# Altium schematic sheet MAIN.SchDoc
size A; SheetNumber: 1; SheetTotal: 8
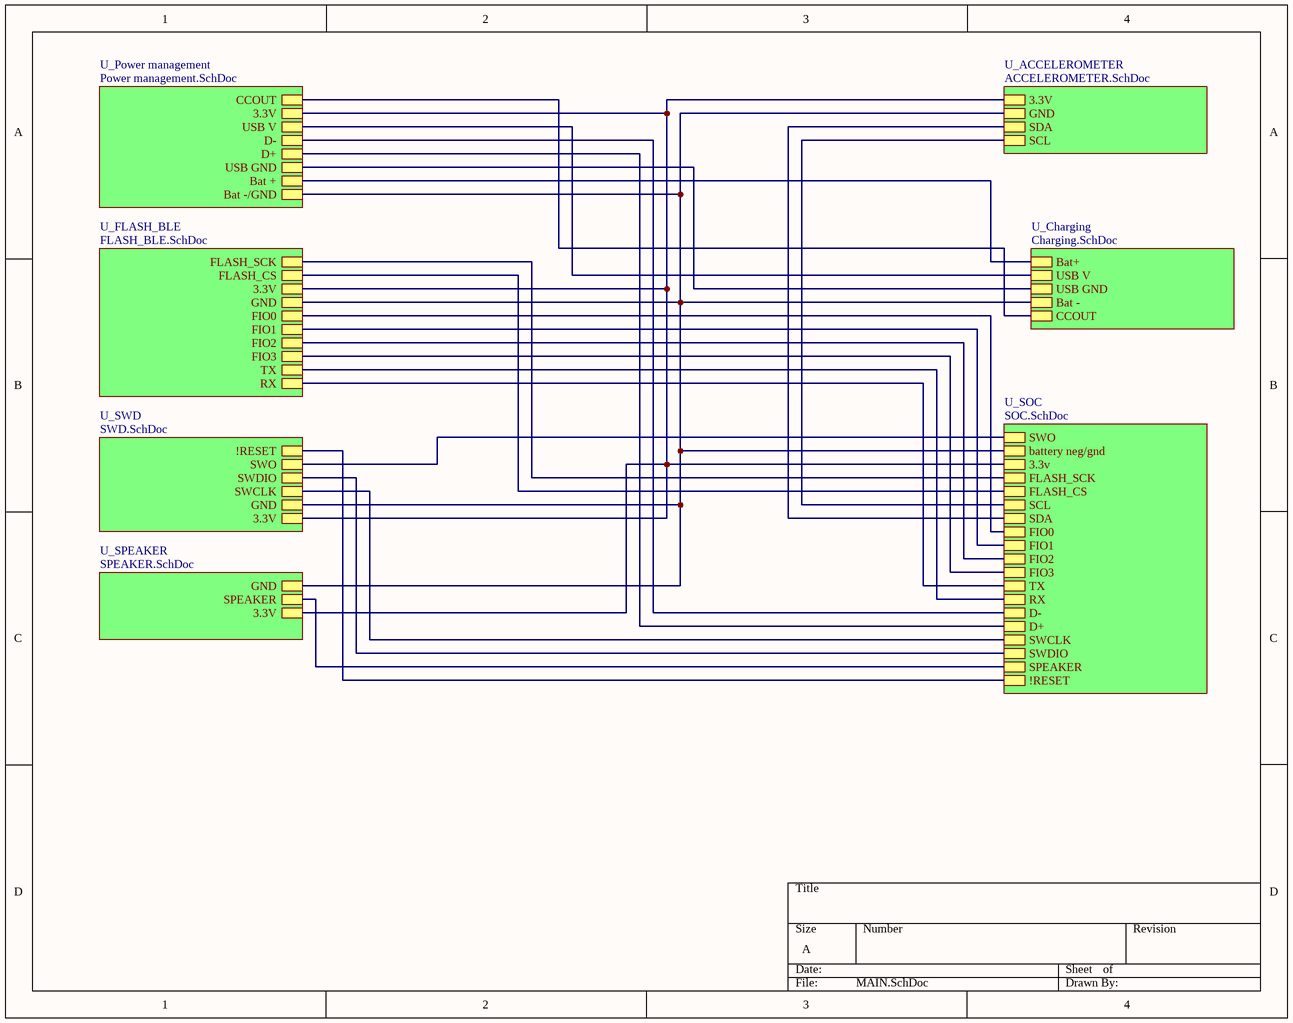
[diagram p0: MAIN.SchDoc]

## Sub-sheets
U_ACCELEROMETER = ACCELEROMETER.SchDoc: 3.3V, GND, SDA, SCL
U_Charging = Charging.SchDoc: Bat+, USB V, USB GND, Bat -, CCOUT
U_FLASH_BLE = FLASH_BLE.SchDoc: FLASH_SCK, FLASH_CS, 3.3V, GND, FIO0, FIO1, FIO2, FIO3, TX, RX
U_Power management = Power management.SchDoc: USB V, D-, D+, USB GND, Bat +, Bat -/GND, 3.3V, CCOUT
U_SOC = SOC.SchDoc: SWO, battery neg/gnd, 3.3v, FLASH_SCK, FLASH_CS, SCL, SDA, FIO0, FIO1, FIO2, FIO3, TX, RX, D-, D+, SWCLK, SWDIO, SPEAKER, !RESET
U_SPEAKER = SPEAKER.SchDoc: GND, SPEAKER, 3.3V
U_SWD = SWD.SchDoc: !RESET, SWO, SWDIO, SWCLK, GND, 3.3V

## Nets
(unnamed): sheet U_ACCELEROMETER/3.3V, sheet U_SOC/3.3v, sheet U_SWD/3.3V, sheet U_SPEAKER/3.3V, sheet U_FLASH_BLE/3.3V, sheet U_Power management/3.3V
(unnamed): sheet U_ACCELEROMETER/GND, sheet U_SOC/battery neg/gnd, sheet U_SWD/GND, sheet U_SPEAKER/GND, sheet U_FLASH_BLE/GND, sheet U_Charging/Bat -, sheet U_Power management/Bat -/GND
(unnamed): sheet U_ACCELEROMETER/SDA, sheet U_SOC/SDA
(unnamed): sheet U_ACCELEROMETER/SCL, sheet U_SOC/SCL
(unnamed): sheet U_SOC/SWO, sheet U_SWD/SWO
(unnamed): sheet U_SOC/FLASH_SCK, sheet U_FLASH_BLE/FLASH_SCK
(unnamed): sheet U_SOC/FLASH_CS, sheet U_FLASH_BLE/FLASH_CS
(unnamed): sheet U_SOC/FIO0, sheet U_FLASH_BLE/FIO0
(unnamed): sheet U_SOC/FIO1, sheet U_FLASH_BLE/FIO1
(unnamed): sheet U_SOC/FIO2, sheet U_FLASH_BLE/FIO2
(unnamed): sheet U_SOC/FIO3, sheet U_FLASH_BLE/FIO3
(unnamed): sheet U_SOC/TX, sheet U_FLASH_BLE/RX
(unnamed): sheet U_SOC/RX, sheet U_FLASH_BLE/TX
(unnamed): sheet U_SOC/D-, sheet U_Power management/D-
(unnamed): sheet U_SOC/D+, sheet U_Power management/D+
(unnamed): sheet U_SOC/SWCLK, sheet U_SWD/SWCLK
(unnamed): sheet U_SOC/SWDIO, sheet U_SWD/SWDIO
(unnamed): sheet U_SOC/SPEAKER, sheet U_SPEAKER/SPEAKER
(unnamed): sheet U_SOC/!RESET, sheet U_SWD/!RESET
(unnamed): sheet U_Charging/Bat+, sheet U_Power management/Bat +
(unnamed): sheet U_Charging/USB V, sheet U_Power management/USB V
(unnamed): sheet U_Charging/USB GND, sheet U_Power management/USB GND
(unnamed): sheet U_Charging/CCOUT, sheet U_Power management/CCOUT